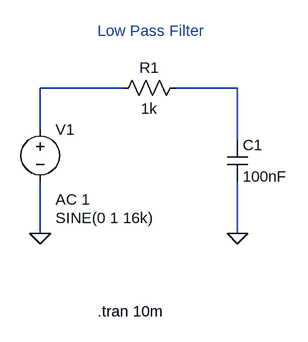
[diagram p0: schematic 5. LPF Transient Analysis.asc]
5. LPF Transient Analysis.asc, the LTspice schematic file:
Version 4
SHEET 1 880 680
WIRE 128 224 0 224
WIRE 304 224 208 224
WIRE 0 288 0 224
WIRE 304 304 304 224
WIRE 0 448 0 368
WIRE 304 448 304 368
FLAG 304 448 0
FLAG 0 448 0
SYMBOL voltage 0 272 R0
WINDOW 3 24 152 Left 2
WINDOW 123 24 124 Left 2
WINDOW 39 0 0 Left 0
SYMATTR InstName V1
SYMATTR Value SINE(0 1 16k)
SYMATTR Value2 AC 1
SYMBOL res 224 208 R90
WINDOW 0 0 56 VBottom 2
WINDOW 3 32 56 VTop 2
SYMATTR InstName R1
SYMATTR Value 1k
SYMBOL cap 288 304 R0
SYMATTR InstName C1
SYMATTR Value 100nF
TEXT 88 136 Left 2 ;Low Pass Filter
TEXT 88 568 Left 2 !.tran 10m

The netlist it stands for:
* 5. LPF Transient Analysis.asc
V1 N001 0 SINE(0 1 16k) AC 1
R1 N002 N001 1k
C1 N002 0 100nF
* Low Pass Filter
.tran 10m
.backanno
.end